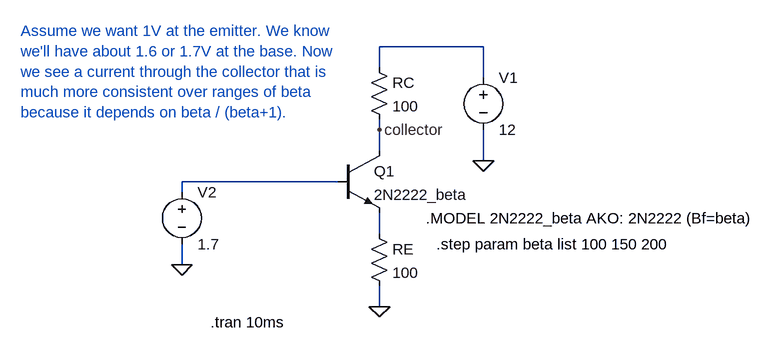
[diagram p0: schematic BaseBias04.asc]
BaseBias04.asc, the LTspice schematic file:
Version 4
SHEET 1 904 680
WIRE 448 -64 288 -64
WIRE 288 -32 288 -64
WIRE 448 -16 448 -64
WIRE 288 64 288 48
WIRE 288 96 288 64
WIRE 448 112 448 64
WIRE 224 144 -16 144
WIRE -16 160 -16 144
WIRE 288 224 288 192
WIRE -16 272 -16 240
WIRE 288 336 288 304
FLAG 448 112 0
FLAG 288 336 0
FLAG -16 272 0
FLAG 288 64 collector
SYMBOL npn 224 96 R0
SYMATTR InstName Q1
SYMATTR Value 2N2222_beta
SYMBOL res 272 208 R0
SYMATTR InstName RE
SYMATTR Value 100
SYMBOL res 272 -48 R0
SYMATTR InstName RC
SYMATTR Value 100
SYMBOL voltage 448 -32 R0
WINDOW 123 0 0 Left 0
WINDOW 39 0 0 Left 0
SYMATTR InstName V1
SYMATTR Value 12
SYMBOL voltage -16 144 R0
WINDOW 123 0 0 Left 0
WINDOW 39 0 0 Left 0
SYMATTR InstName V2
SYMATTR Value 1.7
TEXT 360 200 Left 2 !.MODEL 2N2222_beta AKO: 2N2222 (Bf=beta)
TEXT 376 240 Left 2 !.step param beta list 100 150 200
TEXT 28 360 Left 2 !.tran 10ms
TEXT -264 -88 Left 2 ;Assume we want 1V at the emitter. We know\nwe'll have about 1.6 or 1.7V at the base. Now\nwe see a current through the collector that is\nmuch more consistent over ranges of beta\nbecause it depends on beta / (beta+1).

The netlist it stands for:
* BaseBias04.asc
Q1 collector N002 N003 0 2N2222_beta
RE N003 0 100
RC N001 collector 100
V1 N001 0 12
V2 N002 0 1.7
.model NPN NPN
.model PNP PNP
.lib standard.bjt
.MODEL 2N2222_beta AKO: 2N2222 (Bf=beta)
.step param beta list 100 150 200
.tran 10ms
* Assume we want 1V at the emitter. We know
* we'll have about 1.6 or 1.7V at the base. Now
* we see a current through the collector that is
* much more consistent over ranges of beta
* because it depends on beta / (beta+1).
.backanno
.end